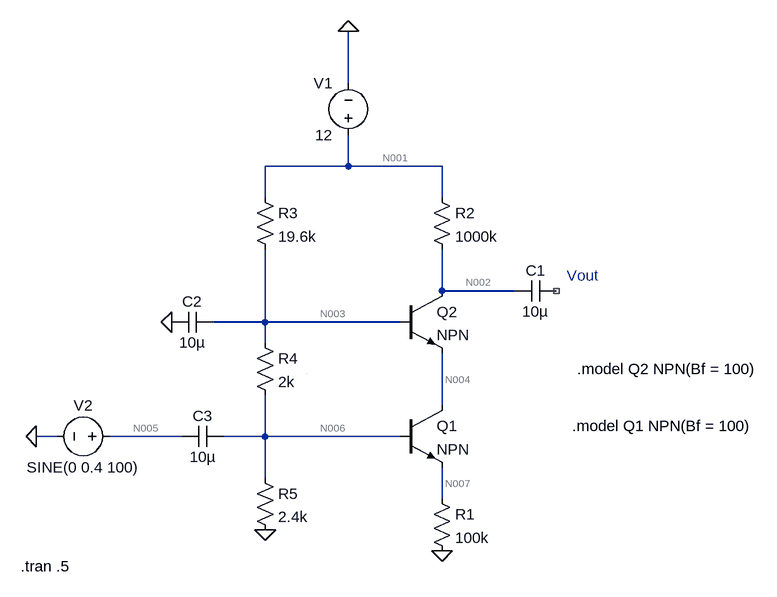
[diagram p0: schematic Draft5.asc]
Draft5.asc, the LTspice schematic file:
Version 4
SHEET 1 880 680
WIRE 160 -352 160 -432
WIRE 160 -224 160 -272
WIRE 160 -224 32 -224
WIRE 304 -224 160 -224
WIRE 32 -176 32 -224
WIRE 304 -176 304 -224
WIRE 304 -32 304 -96
WIRE 416 -32 304 -32
WIRE 32 16 32 -96
WIRE 32 16 -48 16
WIRE 240 16 32 16
WIRE 32 48 32 16
WIRE 304 144 304 64
WIRE -288 192 -320 192
WIRE -96 192 -208 192
WIRE 32 192 32 128
WIRE 32 192 -32 192
WIRE 240 192 32 192
WIRE 32 256 32 192
WIRE 304 288 304 240
FLAG 304 368 0
FLAG 160 -432 0
FLAG -112 16 0
FLAG -320 192 0
FLAG 32 336 0
SYMBOL npn 240 144 R0
SYMATTR InstName Q1
SYMBOL npn 240 -32 R0
SYMATTR InstName Q2
SYMBOL res 288 272 R0
SYMATTR InstName R1
SYMATTR Value 100k
SYMBOL cap 480 -48 R90
WINDOW 0 0 32 VBottom 2
WINDOW 3 32 32 VTop 2
SYMATTR InstName C1
SYMATTR Value 10µ
SYMBOL res 288 -192 R0
SYMATTR InstName R2
SYMATTR Value 1000k
SYMBOL res 16 -192 R0
SYMATTR InstName R3
SYMATTR Value 19.6k
SYMBOL voltage 160 -256 R180
WINDOW 0 24 96 Left 2
WINDOW 3 24 16 Left 2
WINDOW 123 0 0 Left 0
WINDOW 39 0 0 Left 0
SYMATTR InstName V1
SYMATTR Value 12
SYMBOL cap -48 0 R90
WINDOW 0 0 32 VBottom 2
WINDOW 3 32 32 VTop 2
SYMATTR InstName C2
SYMATTR Value 10µ
SYMBOL res 16 32 R0
SYMATTR InstName R4
SYMATTR Value 2k
SYMBOL cap -32 176 R90
WINDOW 0 0 32 VBottom 2
WINDOW 3 32 32 VTop 2
SYMATTR InstName C3
SYMATTR Value 10µ
SYMBOL voltage -192 192 R90
WINDOW 0 -32 56 VBottom 2
WINDOW 3 32 56 VTop 2
WINDOW 123 0 0 Left 0
WINDOW 39 0 0 Left 0
SYMATTR InstName V2
SYMATTR Value SINE(0 0.4 100)
SYMBOL res 16 240 R0
SYMATTR InstName R5
SYMATTR Value 2.4k
TEXT 496 -56 Left 2 ;Vout
TEXT 512 88 Left 2 !.model Q2 NPN(Bf = 100)
TEXT 504 176 Left 2 !.model Q1 NPN(Bf = 100)
TEXT -344 392 Left 2 !.tran .5
LINE Normal 96 96 96 96 2

The netlist it stands for:
* Draft5.asc
Q1 N004 N006 N007 0 NPN
Q2 N002 N003 N004 0 NPN
R1 N007 0 100k
C1 NC_01 N002 10µ
R2 N001 N002 1000k
R3 N001 N003 19.6k
V1 N001 0 12
C2 N003 0 10µ
R4 N003 N006 2k
C3 N006 N005 10µ
V2 N005 0 SINE(0 0.4 100)
R5 N006 0 2.4k
.model NPN NPN
.model PNP PNP
.lib standard.bjt
* Vout
.model Q2 NPN(Bf = 100)
.model Q1 NPN(Bf = 100)
.tran .5
.backanno
.end

* Results of the author's LTspice run, read from the files saved beside the schematic
* Operating Point, zero values left out:
*   V(n004) = 1.56 V
*   V(n006) = 1.2 V
*   V(n007) = 559.9 mV
*   V(n002) = 6.511 V
*   V(n003) = 2.2 V
*   V(n001) = 12 V
*   Ic(Q2) = 5.489 µA
*   Ib(Q2) = 54.89 nA
*   Ie(Q2) = -5.544 µA
*   Ic(Q1) = 5.544 µA
*   Ib(Q1) = 55.44 nA
*   Ie(Q1) = -5.599 µA
*   I(R5) = 499.9 µA
*   I(R4) = 500 µA
*   I(R3) = 500 µA
*   I(R2) = 5.489 µA
*   I(R1) = 5.599 µA
*   I(V1) = -505.5 µA
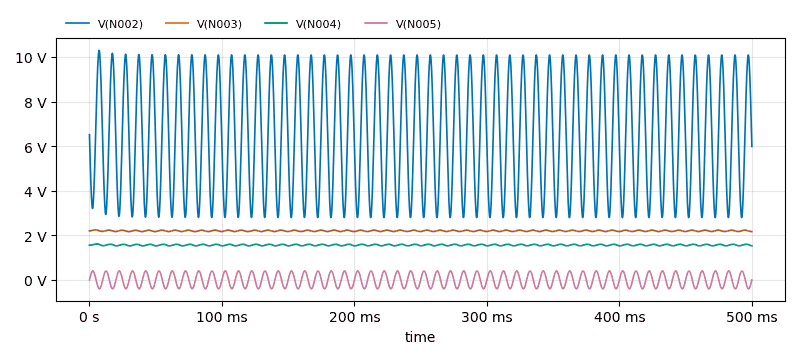
[diagram p1: Transient Analysis of Draft5.asc, plotted from the saved traces]
* Transient Analysis, 1 run:
*   V(N002): min 2.796 V, max 10.3 V, average 6.49 V, rms 6.977 V, last 5.986 V
*   V(N003): min 2.167 V, max 2.245 V, average 2.2 V, rms 2.2 V, last 2.169 V
*   V(N004): min 1.525 V, max 1.61 V, average 1.564 V, rms 1.564 V, last 1.528 V
*   V(N005): min -400 mV, max 400 mV, average 583.1 nV, rms 283.6 mV, last 0 V